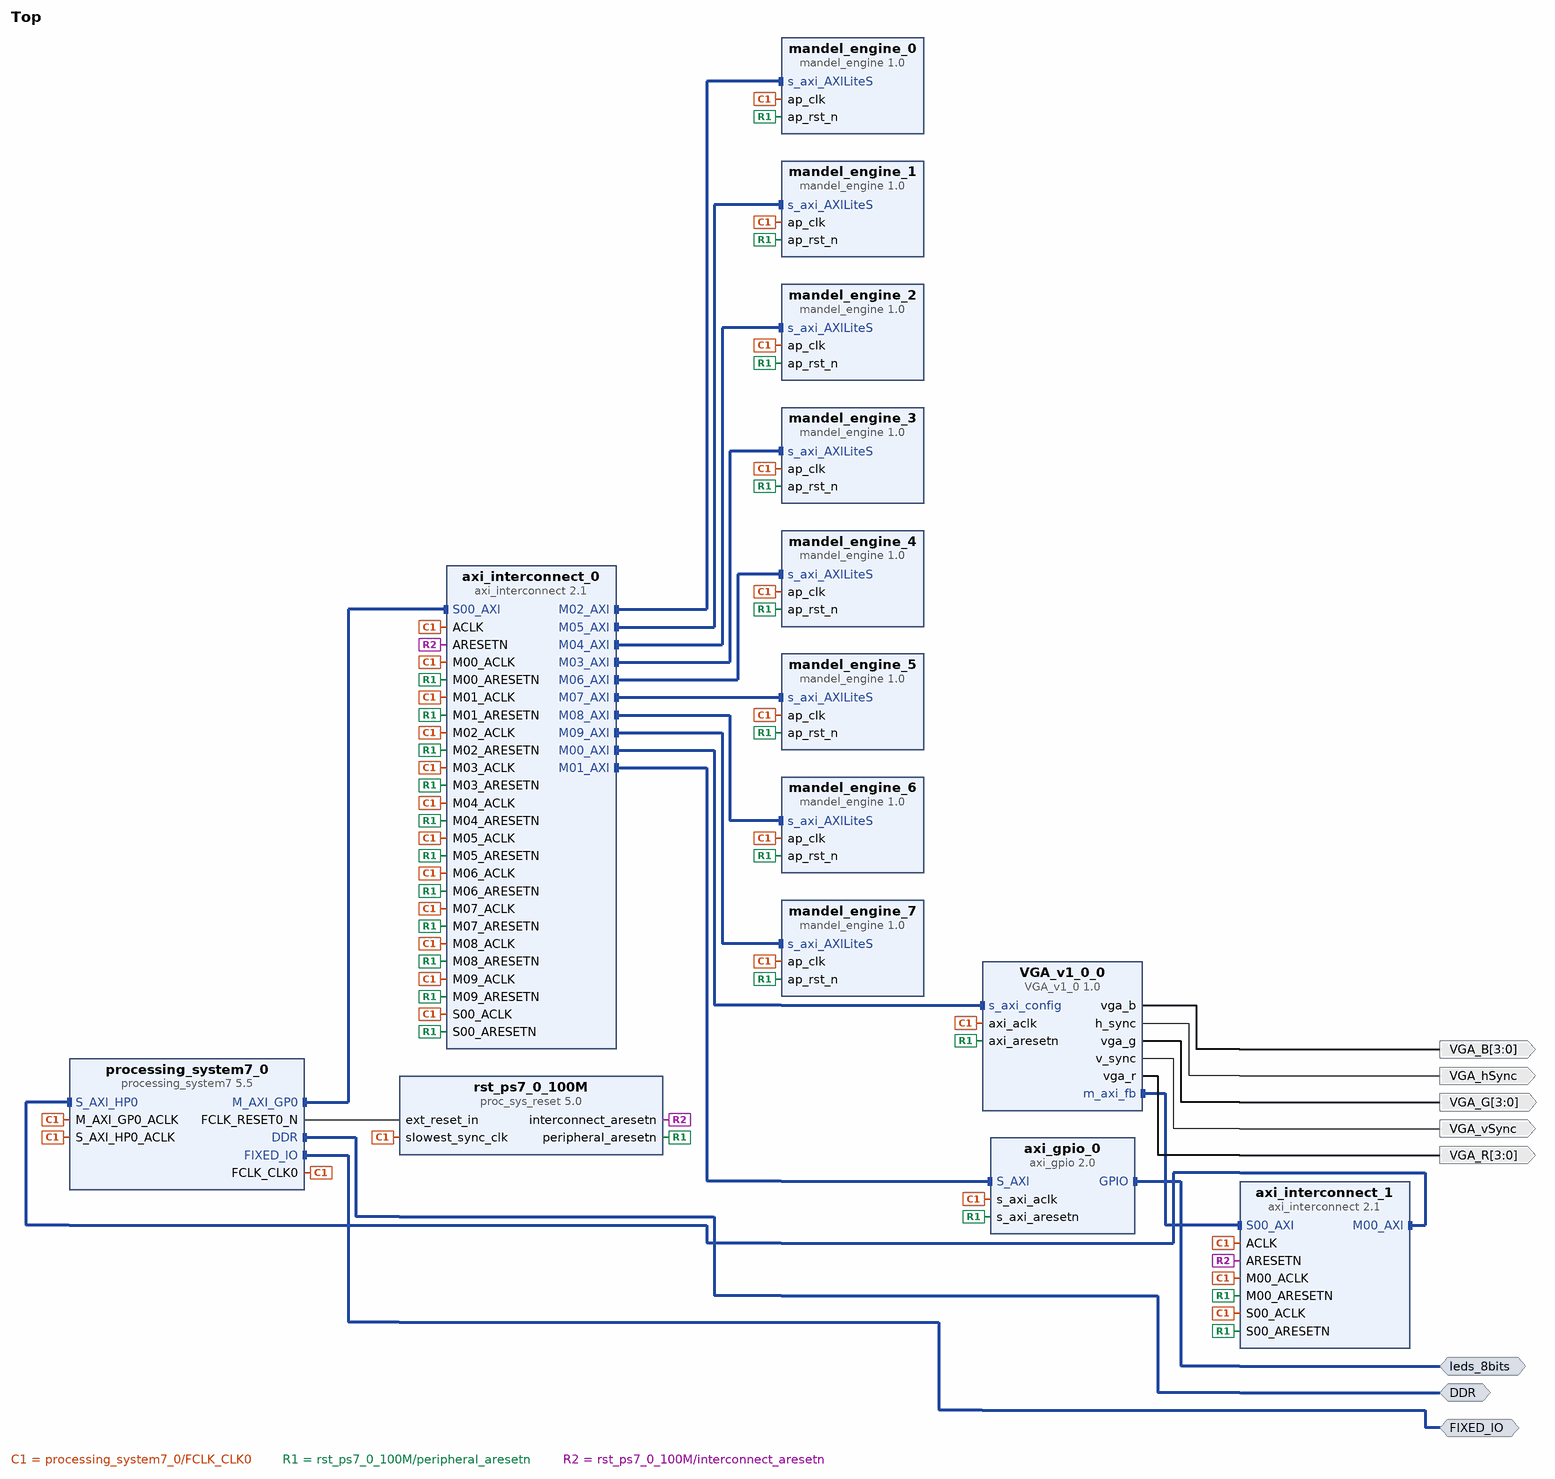
[diagram p0: block diagram of the top level]
# Vivado block design Top, xc7z020clg484-1, Vivado 2017.4
create_bd_design Top

create_bd_intf_port -mode Master -vlnv xilinx.com:interface:ddrx_rtl:1.0 DDR
create_bd_intf_port -mode Master -vlnv xilinx.com:display_processing_system7:fixedio_rtl:1.0 FIXED_IO
create_bd_intf_port -mode Master -vlnv xilinx.com:interface:gpio_rtl:1.0 leds_8bits
create_bd_port -dir O VGA_hSync
create_bd_port -dir O VGA_vSync
create_bd_port -dir O -from 3 -to 0 VGA_B
create_bd_port -dir O -from 3 -to 0 VGA_G
create_bd_port -dir O -from 3 -to 0 VGA_R

create_bd_cell -type ip -vlnv xilinx.com:ip:processing_system7:5.5 processing_system7_0
set_property -dict [list \
  CONFIG.PCW_UIPARAM_DDR_FREQ_MHZ 533.333313 \
  CONFIG.PCW_APU_PERIPHERAL_FREQMHZ 666.666667 \
  CONFIG.PCW_QSPI_PERIPHERAL_FREQMHZ 200.000000 \
  CONFIG.PCW_SDIO_PERIPHERAL_FREQMHZ 50 \
  CONFIG.PCW_UART_PERIPHERAL_FREQMHZ 50 \
  CONFIG.PCW_FPGA0_PERIPHERAL_FREQMHZ 100.000000 \
  CONFIG.PCW_FPGA1_PERIPHERAL_FREQMHZ 150.000000 \
  CONFIG.PCW_FPGA2_PERIPHERAL_FREQMHZ 50.000000 \
  CONFIG.PCW_USE_S_AXI_HP0 1 \
  CONFIG.PCW_PRESET_BANK1_VOLTAGE {LVCMOS 1.8V} \
  CONFIG.PCW_UIPARAM_DDR_PARTNO {MT41J128M16 HA-15E} \
  CONFIG.PCW_QSPI_PERIPHERAL_ENABLE 1 \
  CONFIG.PCW_QSPI_QSPI_IO {MIO 1 .. 6} \
  CONFIG.PCW_QSPI_GRP_SINGLE_SS_ENABLE 1 \
  CONFIG.PCW_QSPI_GRP_SINGLE_SS_IO {MIO 1 .. 6} \
  CONFIG.PCW_SINGLE_QSPI_DATA_MODE x4 \
  CONFIG.PCW_ENET0_PERIPHERAL_ENABLE 1 \
  CONFIG.PCW_ENET0_ENET0_IO {MIO 16 .. 27} \
  CONFIG.PCW_ENET0_GRP_MDIO_ENABLE 1 \
  CONFIG.PCW_ENET0_GRP_MDIO_IO {MIO 52 .. 53} \
  CONFIG.PCW_ENET_RESET_ENABLE 1 \
  CONFIG.PCW_ENET_RESET_SELECT {Share reset pin} \
  CONFIG.PCW_ENET0_RESET_ENABLE 0 \
  CONFIG.PCW_SD0_PERIPHERAL_ENABLE 1 \
  CONFIG.PCW_SD0_SD0_IO {MIO 40 .. 45} \
  CONFIG.PCW_SD0_GRP_CD_ENABLE 1 \
  CONFIG.PCW_SD0_GRP_CD_IO {MIO 47} \
  CONFIG.PCW_SD0_GRP_WP_ENABLE 1 \
  CONFIG.PCW_SD0_GRP_WP_IO {MIO 46} \
  CONFIG.PCW_UART1_PERIPHERAL_ENABLE 1 \
  CONFIG.PCW_UART1_UART1_IO {MIO 48 .. 49} \
  CONFIG.PCW_TTC0_PERIPHERAL_ENABLE 1 \
  CONFIG.PCW_TTC0_TTC0_IO EMIO \
  CONFIG.PCW_USB0_PERIPHERAL_ENABLE 1 \
  CONFIG.PCW_USB0_USB0_IO {MIO 28 .. 39} \
  CONFIG.PCW_USB_RESET_ENABLE 1 \
  CONFIG.PCW_USB_RESET_SELECT {Share reset pin} \
  CONFIG.PCW_USB0_RESET_ENABLE 0 \
  CONFIG.PCW_I2C_RESET_ENABLE 1 \
  CONFIG.PCW_GPIO_MIO_GPIO_ENABLE 1 \
  CONFIG.PCW_GPIO_MIO_GPIO_IO MIO \
  CONFIG.preset ZedBoard \
] [get_bd_cells processing_system7_0]
# 221 more settings of processing_system7_0 are not shown: defaults, MIO pin electricals, DDR timing, and values the tool derives
create_bd_cell -type ip -vlnv xilinx.com:ip:axi_interconnect:2.1 axi_interconnect_0
set_property -dict {CONFIG.NUM_MI 10} [get_bd_cells axi_interconnect_0]
create_bd_cell -type ip -vlnv xilinx.com:ip:proc_sys_reset:5.0 rst_ps7_0_100M
create_bd_cell -type ip -vlnv xilinx.com:ip:axi_interconnect:2.1 axi_interconnect_1
set_property -dict {CONFIG.NUM_MI 1} [get_bd_cells axi_interconnect_1]
create_bd_cell -type ip -vlnv xilinx.com:ip:axi_gpio:2.0 axi_gpio_0
set_property -dict {CONFIG.USE_BOARD_FLOW true CONFIG.GPIO_BOARD_INTERFACE leds_8bits} [get_bd_cells axi_gpio_0]
create_bd_cell -type ip -vlnv xilinx.com:user:VGA_v1_0:1.0 VGA_v1_0_0
create_bd_cell -type ip -vlnv xilinx.com:hls:mandel_engine:1.0 mandel_engine_0
create_bd_cell -type ip -vlnv xilinx.com:hls:mandel_engine:1.0 mandel_engine_1
create_bd_cell -type ip -vlnv xilinx.com:hls:mandel_engine:1.0 mandel_engine_2
create_bd_cell -type ip -vlnv xilinx.com:hls:mandel_engine:1.0 mandel_engine_3
create_bd_cell -type ip -vlnv xilinx.com:hls:mandel_engine:1.0 mandel_engine_4
create_bd_cell -type ip -vlnv xilinx.com:hls:mandel_engine:1.0 mandel_engine_5
create_bd_cell -type ip -vlnv xilinx.com:hls:mandel_engine:1.0 mandel_engine_6
create_bd_cell -type ip -vlnv xilinx.com:hls:mandel_engine:1.0 mandel_engine_7

# ---- connections ----

connect_bd_intf_net [get_bd_intf_pins axi_interconnect_0/S00_AXI] [get_bd_intf_pins processing_system7_0/M_AXI_GP0]
connect_bd_intf_net [get_bd_intf_pins axi_interconnect_1/M00_AXI] [get_bd_intf_pins processing_system7_0/S_AXI_HP0]
connect_bd_intf_net [get_bd_intf_pins axi_gpio_0/S_AXI] [get_bd_intf_pins axi_interconnect_0/M01_AXI]
connect_bd_intf_net [get_bd_intf_pins axi_interconnect_0/M00_AXI] [get_bd_intf_pins VGA_v1_0_0/s_axi_config]
connect_bd_intf_net [get_bd_intf_pins VGA_v1_0_0/m_axi_fb] [get_bd_intf_pins axi_interconnect_1/S00_AXI]
connect_bd_intf_net [get_bd_intf_pins mandel_engine_0/s_axi_AXILiteS] [get_bd_intf_pins axi_interconnect_0/M02_AXI]
connect_bd_intf_net [get_bd_intf_pins mandel_engine_3/s_axi_AXILiteS] [get_bd_intf_pins axi_interconnect_0/M03_AXI]
connect_bd_intf_net [get_bd_intf_pins mandel_engine_2/s_axi_AXILiteS] [get_bd_intf_pins axi_interconnect_0/M04_AXI]
connect_bd_intf_net [get_bd_intf_pins mandel_engine_1/s_axi_AXILiteS] [get_bd_intf_pins axi_interconnect_0/M05_AXI]
connect_bd_intf_net [get_bd_intf_pins mandel_engine_4/s_axi_AXILiteS] [get_bd_intf_pins axi_interconnect_0/M06_AXI]
connect_bd_intf_net [get_bd_intf_pins mandel_engine_5/s_axi_AXILiteS] [get_bd_intf_pins axi_interconnect_0/M07_AXI]
connect_bd_intf_net [get_bd_intf_pins mandel_engine_6/s_axi_AXILiteS] [get_bd_intf_pins axi_interconnect_0/M08_AXI]
connect_bd_intf_net [get_bd_intf_pins mandel_engine_7/s_axi_AXILiteS] [get_bd_intf_pins axi_interconnect_0/M09_AXI]
connect_bd_intf_net [get_bd_intf_ports DDR] [get_bd_intf_pins processing_system7_0/DDR]
connect_bd_intf_net [get_bd_intf_ports FIXED_IO] [get_bd_intf_pins processing_system7_0/FIXED_IO]
connect_bd_intf_net [get_bd_intf_ports leds_8bits] [get_bd_intf_pins axi_gpio_0/GPIO]
connect_bd_net [get_bd_pins processing_system7_0/FCLK_CLK0] \
  [get_bd_pins processing_system7_0/M_AXI_GP0_ACLK] [get_bd_pins axi_interconnect_0/S00_ACLK] \
  [get_bd_pins rst_ps7_0_100M/slowest_sync_clk] [get_bd_pins axi_interconnect_0/ACLK] \
  [get_bd_pins processing_system7_0/S_AXI_HP0_ACLK] [get_bd_pins axi_interconnect_1/M00_ACLK] \
  [get_bd_pins axi_interconnect_0/M00_ACLK] [get_bd_pins axi_interconnect_0/M01_ACLK] [get_bd_pins axi_gpio_0/s_axi_aclk] \
  [get_bd_pins axi_interconnect_1/ACLK] [get_bd_pins axi_interconnect_1/S00_ACLK] [get_bd_pins VGA_v1_0_0/axi_aclk] \
  [get_bd_pins axi_interconnect_0/M02_ACLK] [get_bd_pins axi_interconnect_0/M03_ACLK] \
  [get_bd_pins axi_interconnect_0/M04_ACLK] [get_bd_pins axi_interconnect_0/M05_ACLK] \
  [get_bd_pins axi_interconnect_0/M06_ACLK] [get_bd_pins axi_interconnect_0/M07_ACLK] \
  [get_bd_pins axi_interconnect_0/M08_ACLK] [get_bd_pins axi_interconnect_0/M09_ACLK] [get_bd_pins mandel_engine_0/ap_clk] \
  [get_bd_pins mandel_engine_1/ap_clk] [get_bd_pins mandel_engine_2/ap_clk] [get_bd_pins mandel_engine_3/ap_clk] \
  [get_bd_pins mandel_engine_4/ap_clk] [get_bd_pins mandel_engine_5/ap_clk] [get_bd_pins mandel_engine_6/ap_clk] \
  [get_bd_pins mandel_engine_7/ap_clk]
connect_bd_net [get_bd_pins processing_system7_0/FCLK_RESET0_N] [get_bd_pins rst_ps7_0_100M/ext_reset_in]
connect_bd_net [get_bd_pins rst_ps7_0_100M/peripheral_aresetn] \
  [get_bd_pins axi_interconnect_0/S00_ARESETN] [get_bd_pins axi_interconnect_1/M00_ARESETN] \
  [get_bd_pins axi_interconnect_0/M00_ARESETN] [get_bd_pins axi_interconnect_0/M01_ARESETN] \
  [get_bd_pins axi_gpio_0/s_axi_aresetn] [get_bd_pins axi_interconnect_1/S00_ARESETN] [get_bd_pins VGA_v1_0_0/axi_aresetn] \
  [get_bd_pins axi_interconnect_0/M02_ARESETN] [get_bd_pins axi_interconnect_0/M03_ARESETN] \
  [get_bd_pins axi_interconnect_0/M04_ARESETN] [get_bd_pins axi_interconnect_0/M05_ARESETN] \
  [get_bd_pins axi_interconnect_0/M06_ARESETN] [get_bd_pins axi_interconnect_0/M07_ARESETN] \
  [get_bd_pins axi_interconnect_0/M08_ARESETN] [get_bd_pins axi_interconnect_0/M09_ARESETN] \
  [get_bd_pins mandel_engine_0/ap_rst_n] [get_bd_pins mandel_engine_1/ap_rst_n] [get_bd_pins mandel_engine_2/ap_rst_n] \
  [get_bd_pins mandel_engine_3/ap_rst_n] [get_bd_pins mandel_engine_4/ap_rst_n] [get_bd_pins mandel_engine_5/ap_rst_n] \
  [get_bd_pins mandel_engine_6/ap_rst_n] [get_bd_pins mandel_engine_7/ap_rst_n]
connect_bd_net [get_bd_pins rst_ps7_0_100M/interconnect_aresetn] [get_bd_pins axi_interconnect_0/ARESETN] [get_bd_pins axi_interconnect_1/ARESETN]
connect_bd_net [get_bd_pins VGA_v1_0_0/h_sync] [get_bd_ports VGA_hSync]
connect_bd_net [get_bd_pins VGA_v1_0_0/v_sync] [get_bd_ports VGA_vSync]
connect_bd_net [get_bd_pins VGA_v1_0_0/vga_b] [get_bd_ports VGA_B]
connect_bd_net [get_bd_pins VGA_v1_0_0/vga_g] [get_bd_ports VGA_G]
connect_bd_net [get_bd_pins VGA_v1_0_0/vga_r] [get_bd_ports VGA_R]

# ---- address map ----
assign_bd_address -offset 0x41200000 -range 64K -target_address_space [get_bd_addr_spaces processing_system7_0/Data] [get_bd_addr_segs axi_gpio_0/S_AXI/Reg]
assign_bd_address -offset 0x43C00000 -range 64K -target_address_space [get_bd_addr_spaces processing_system7_0/Data] [get_bd_addr_segs VGA_v1_0_0/s_axi_config/reg0]
assign_bd_address -offset 0x43C10000 -range 64K -target_address_space [get_bd_addr_spaces processing_system7_0/Data] [get_bd_addr_segs mandel_engine_0/s_axi_AXILiteS/Reg]
assign_bd_address -offset 0x43C20000 -range 64K -target_address_space [get_bd_addr_spaces processing_system7_0/Data] [get_bd_addr_segs mandel_engine_1/s_axi_AXILiteS/Reg]
assign_bd_address -offset 0x43C30000 -range 64K -target_address_space [get_bd_addr_spaces processing_system7_0/Data] [get_bd_addr_segs mandel_engine_2/s_axi_AXILiteS/Reg]
assign_bd_address -offset 0x43C40000 -range 64K -target_address_space [get_bd_addr_spaces processing_system7_0/Data] [get_bd_addr_segs mandel_engine_3/s_axi_AXILiteS/Reg]
assign_bd_address -offset 0x43C50000 -range 64K -target_address_space [get_bd_addr_spaces processing_system7_0/Data] [get_bd_addr_segs mandel_engine_4/s_axi_AXILiteS/Reg]
assign_bd_address -offset 0x43C60000 -range 64K -target_address_space [get_bd_addr_spaces processing_system7_0/Data] [get_bd_addr_segs mandel_engine_5/s_axi_AXILiteS/Reg]
assign_bd_address -offset 0x43C70000 -range 64K -target_address_space [get_bd_addr_spaces processing_system7_0/Data] [get_bd_addr_segs mandel_engine_6/s_axi_AXILiteS/Reg]
assign_bd_address -offset 0x43C80000 -range 64K -target_address_space [get_bd_addr_spaces processing_system7_0/Data] [get_bd_addr_segs mandel_engine_7/s_axi_AXILiteS/Reg]
assign_bd_address -offset 0x00000000 -range 512M -target_address_space [get_bd_addr_spaces VGA_v1_0_0/m_axi_fb] [get_bd_addr_segs processing_system7_0/S_AXI_HP0/HP0_DDR_LOWOCM]

validate_bd_design
save_bd_design
